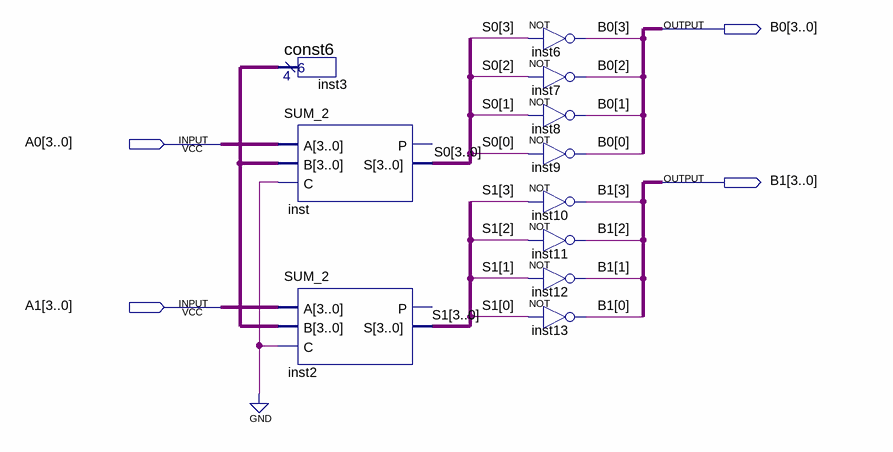
[diagram p0: schematic sheet]
// Quartus schematic inverse.bdf as structural Verilog: 11 symbols, 4 pins
module inverse (
  input  [3:0] A0,
  input  [3:0] A1,
  output [3:0] B0,
  output [3:0] B1
);

  wire [3:0] inst3_result, S0, S1;

  const6 inst3 (.result(inst3_result));
  SUM_2 inst (.A(A0), .B(inst3_result), .C(1'b0), .S(S0));  // open: P
  SUM_2 inst2 (.A(A1), .B(inst3_result), .C(1'b0), .S(S1));  // open: P
  not inst6 (B0[3], S0[3]);
  not inst7 (B0[2], S0[2]);
  not inst8 (B0[1], S0[1]);
  not inst9 (B0[0], S0[0]);
  not inst10 (B1[3], S1[3]);
  not inst11 (B1[2], S1[2]);
  not inst12 (B1[1], S1[1]);
  not inst13 (B1[0], S1[0]);
endmodule
